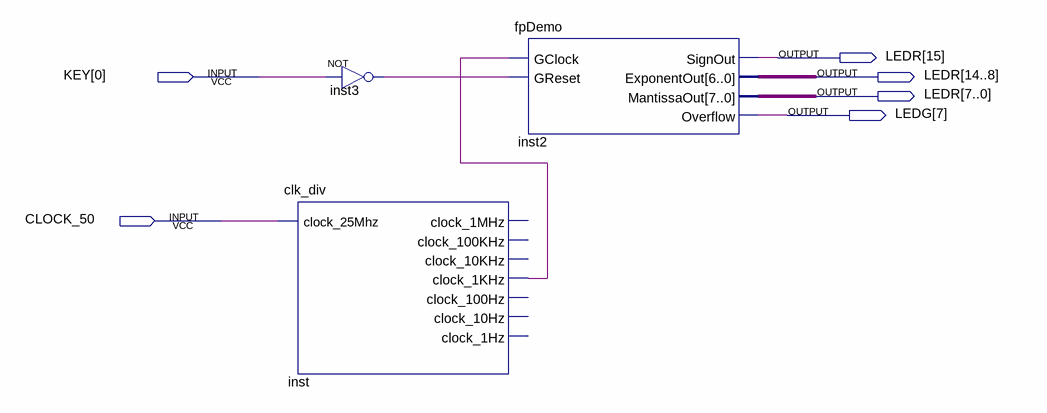
[diagram p0: schematic sheet]
// Quartus schematic TopLevel.bdf as structural Verilog: 3 symbols, 6 pins
module TopLevel (
  input  [0:0] KEY,
  input  CLOCK_50,
  output [15:0] LEDR,
  output [7:7] LEDG
);

  wire inst3_out, inst_clock_1khz;

  not inst3 (inst3_out, KEY[0]);
  clk_div inst (
    .clock_25Mhz(CLOCK_50), .clock_1KHz(inst_clock_1khz));  // open: clock_1MHz, clock_100KHz, clock_10KHz, clock_100Hz, clock_10Hz, clock_1Hz
  fpDemo inst2 (
    .GClock(inst_clock_1khz), .GReset(inst3_out), .SignOut(LEDR[15]), .ExponentOut(LEDR[14:8]),
    .MantissaOut(LEDR[7:0]), .Overflow(LEDG[7]));
endmodule
